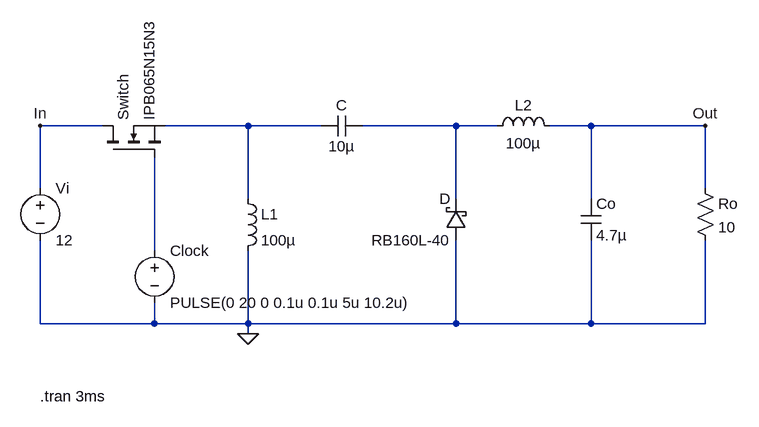
[diagram p0: schematic Zeta Converter.asc]
Zeta Converter.asc, the LTspice schematic file:
Version 4
SHEET 1 880 680
WIRE -288 -64 -384 -64
WIRE -64 -64 -192 -64
WIRE 48 -64 -64 -64
WIRE 256 -64 112 -64
WIRE 320 -64 256 -64
WIRE 464 -64 400 -64
WIRE 640 -64 464 -64
WIRE -384 32 -384 -64
WIRE 640 32 640 -64
WIRE -64 48 -64 -64
WIRE 256 48 256 -64
WIRE 464 48 464 -64
WIRE -208 128 -208 -16
WIRE -384 240 -384 112
WIRE -208 240 -208 208
WIRE -208 240 -384 240
WIRE -64 240 -64 128
WIRE -64 240 -208 240
WIRE 256 240 256 112
WIRE 256 240 -64 240
WIRE 464 240 464 112
WIRE 464 240 256 240
WIRE 640 240 640 112
WIRE 640 240 464 240
WIRE -64 256 -64 240
FLAG -64 256 0
FLAG 640 -64 Out
FLAG -384 -64 In
SYMBOL nmos -288 -16 R270
SYMATTR InstName Switch
SYMATTR Value IPB065N15N3
SYMBOL schottky 272 112 R180
WINDOW 0 24 64 Left 2
WINDOW 3 24 0 Left 2
SYMATTR InstName D
SYMATTR Value RB160L-40
SYMATTR Description Diode
SYMATTR Type diode
SYMBOL cap 448 48 R0
SYMATTR InstName Co
SYMATTR Value 4.7µ
SYMBOL res 624 16 R0
SYMATTR InstName Ro
SYMATTR Value 10
SYMBOL voltage -208 112 R0
WINDOW 123 0 0 Left 2
WINDOW 39 0 0 Left 2
SYMATTR InstName Clock
SYMATTR Value PULSE(0 20 0 0.1u 0.1u 5u 10.2u)
SYMBOL voltage -384 16 R0
WINDOW 123 0 0 Left 2
WINDOW 39 0 0 Left 2
SYMATTR InstName Vi
SYMATTR Value 12
SYMBOL cap 112 -48 M270
WINDOW 0 32 32 VTop 2
WINDOW 3 0 32 VBottom 2
SYMATTR InstName C
SYMATTR Value 10µ
SYMBOL ind 416 -48 M270
WINDOW 0 32 56 VTop 2
WINDOW 3 5 56 VBottom 2
SYMATTR InstName L2
SYMATTR Value 100µ
SYMBOL ind -80 32 R0
SYMATTR InstName L1
SYMATTR Value 100µ
TEXT -384 352 Left 2 !.tran 3ms

The netlist it stands for:
* Zeta Converter.asc
M§Switch In N003 N001 N001 IPB065N15N3
D 0 N002 RB160L-40
Co Out 0 4.7µ
Ro Out 0 10
V§Clock N003 0 PULSE(0 20 0 0.1u 0.1u 5u 10.2u)
Vi In 0 12
C N002 N001 10µ
L2 Out N002 100µ
L1 N001 0 100µ
.model D D
.lib standard.dio
.model NMOS NMOS
.model PMOS PMOS
.lib standard.mos
.tran 3ms
.backanno
.end